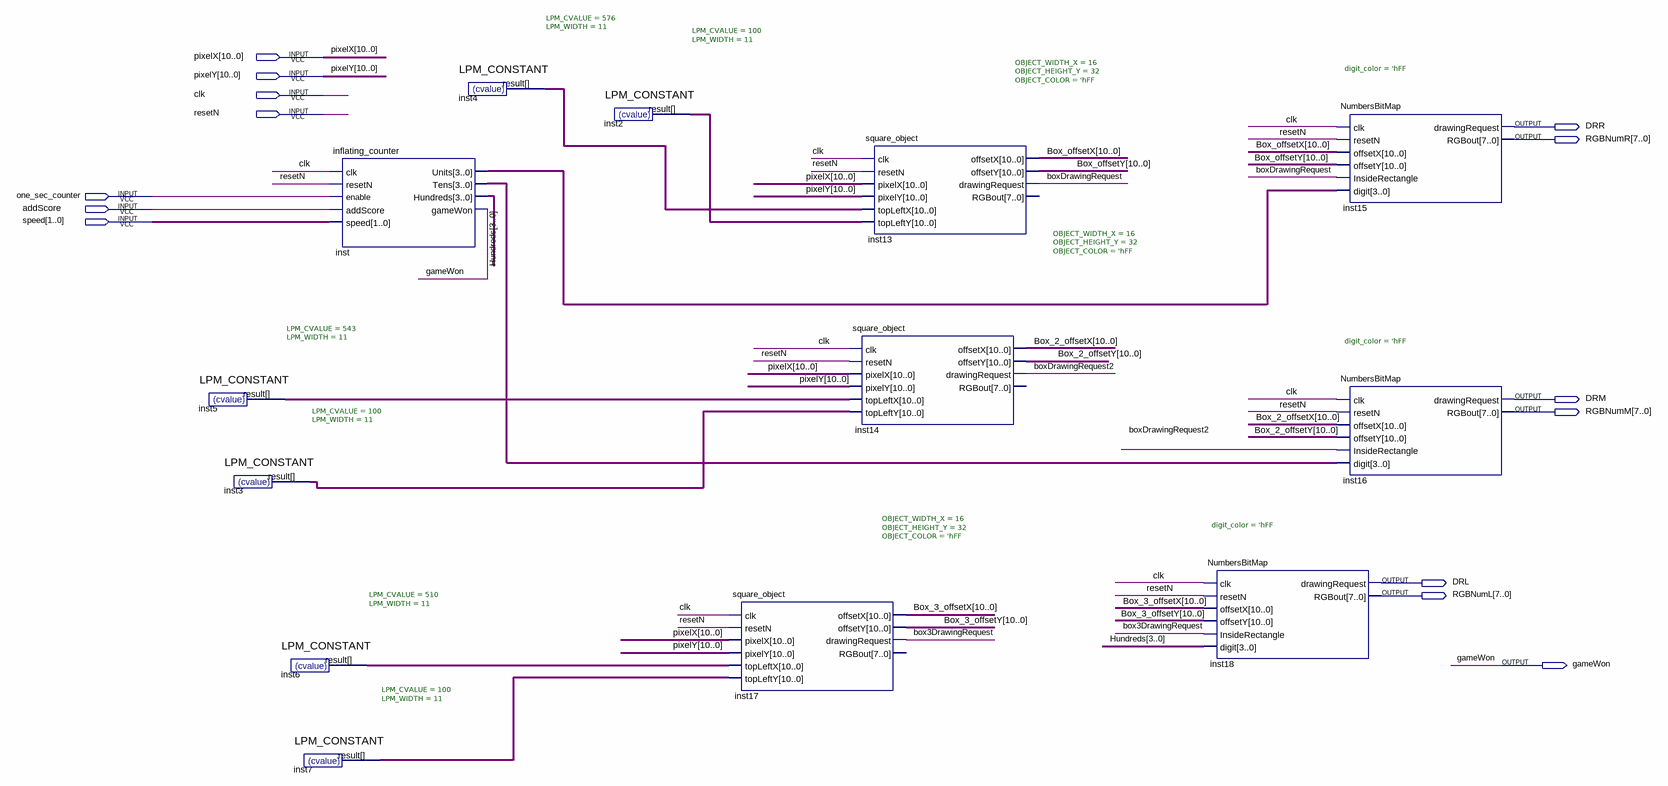
[diagram p0: schematic sheet]
// Quartus schematic scoreDisplay.bdf as structural Verilog: 13 symbols, 14 pins
module scoreDisplay (
  input  [10:0] pixelX,
  input  [10:0] pixelY,
  input  clk,
  input  resetN,
  input  one_sec_counter,
  input  addScore,
  input  [1:0] speed,
  output DRR,
  output [7:0] RGBNumR,
  output DRM,
  output [7:0] RGBNumM,
  output DRL,
  output [7:0] RGBNumL,
  output gameWon
);

  wire box3DrawingRequest, boxDrawingRequest, boxDrawingRequest2;
  wire [3:0] Hundreds, inst_tens, inst_units;
  wire [10:0] Box_2_offsetX, Box_2_offsetY, Box_3_offsetX, Box_3_offsetY, Box_offsetX, Box_offsetY,
       inst2_result, inst3_result, inst4_result, inst5_result, inst6_result, inst7_result;

  LPM_CONSTANT #(.LPM_CVALUE(543), .LPM_WIDTH(11)) inst5 (.result(inst5_result));
  LPM_CONSTANT #(.LPM_CVALUE(100), .LPM_WIDTH(11)) inst3 (.result(inst3_result));
  LPM_CONSTANT #(.LPM_CVALUE(510), .LPM_WIDTH(11)) inst6 (.result(inst6_result));
  inflating_counter inst (
    .clk(clk), .resetN(resetN), .enable(one_sec_counter), .addScore(addScore), .speed(speed),
    .Units(inst_units), .Tens(inst_tens), .Hundreds(Hundreds), .gameWon(gameWon));
  LPM_CONSTANT #(.LPM_CVALUE(100), .LPM_WIDTH(11)) inst7 (.result(inst7_result));
  LPM_CONSTANT #(.LPM_CVALUE(576), .LPM_WIDTH(11)) inst4 (.result(inst4_result));
  LPM_CONSTANT #(.LPM_CVALUE(100), .LPM_WIDTH(11)) inst2 (.result(inst2_result));
  square_object #(.OBJECT_WIDTH_X(16), .OBJECT_HEIGHT_Y(32), .OBJECT_COLOR('hFF)) inst17 (
    .clk(clk), .resetN(resetN), .pixelX(pixelX), .pixelY(pixelY), .topLeftX(inst6_result),
    .topLeftY(inst7_result), .offsetX(Box_3_offsetX), .offsetY(Box_3_offsetY),
    .drawingRequest(box3DrawingRequest));  // open: RGBout
  square_object #(.OBJECT_WIDTH_X(16), .OBJECT_HEIGHT_Y(32), .OBJECT_COLOR('hFF)) inst13 (
    .clk(clk), .resetN(resetN), .pixelX(pixelX), .pixelY(pixelY), .topLeftX(inst4_result),
    .topLeftY(inst2_result), .offsetX(Box_offsetX), .offsetY(Box_offsetY), .drawingRequest(boxDrawingRequest));  // open: RGBout
  square_object #(.OBJECT_WIDTH_X(16), .OBJECT_HEIGHT_Y(32), .OBJECT_COLOR('hFF)) inst14 (
    .clk(clk), .resetN(resetN), .pixelX(pixelX), .pixelY(pixelY), .topLeftX(inst5_result),
    .topLeftY(inst3_result), .offsetX(Box_2_offsetX), .offsetY(Box_2_offsetY),
    .drawingRequest(boxDrawingRequest2));  // open: RGBout
  NumbersBitMap #(.digit_color('hFF)) inst18 (
    .clk(clk), .resetN(resetN), .offsetX(Box_3_offsetX), .offsetY(Box_3_offsetY),
    .InsideRectangle(box3DrawingRequest), .digit(Hundreds), .drawingRequest(DRL), .RGBout(RGBNumL));
  NumbersBitMap #(.digit_color('hFF)) inst15 (
    .clk(clk), .resetN(resetN), .offsetX(Box_offsetX), .offsetY(Box_offsetY),
    .InsideRectangle(boxDrawingRequest), .digit(inst_units), .drawingRequest(DRR), .RGBout(RGBNumR));
  NumbersBitMap #(.digit_color('hFF)) inst16 (
    .clk(clk), .resetN(resetN), .offsetX(Box_2_offsetX), .offsetY(Box_2_offsetY),
    .InsideRectangle(boxDrawingRequest2), .digit(inst_tens), .drawingRequest(DRM), .RGBout(RGBNumM));
endmodule
